# Altium schematic sheet STM32F103C8T6.SchDoc
size A4
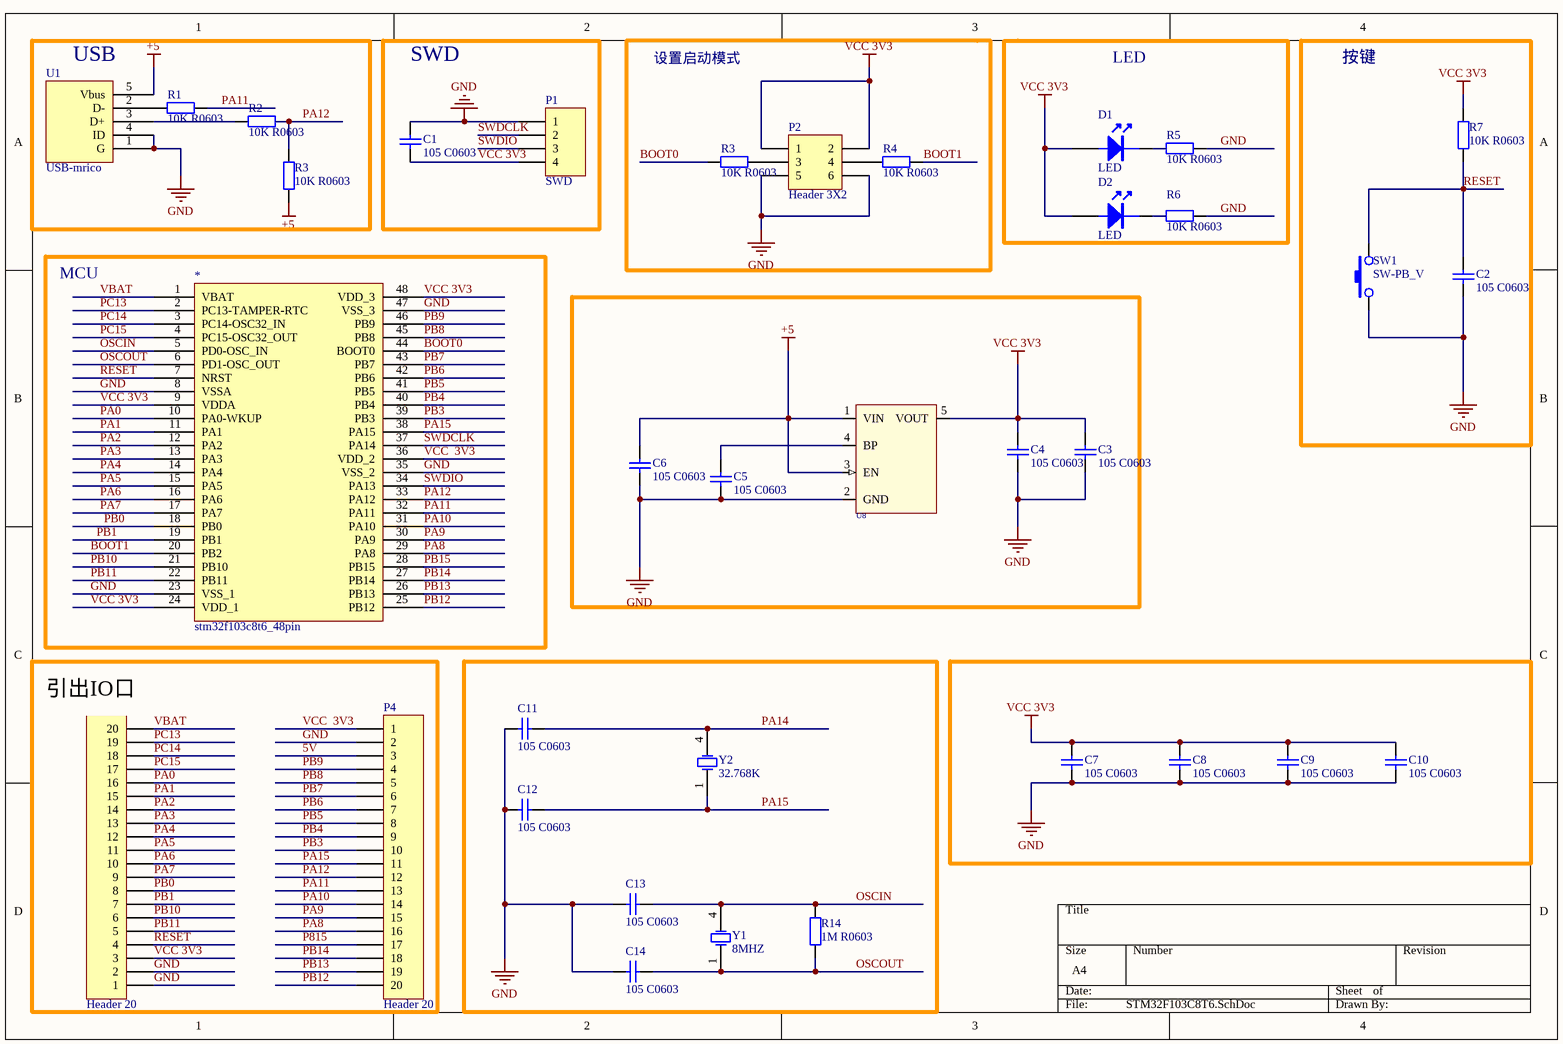
[diagram p0: STM32F103C8T6.SchDoc]

## Parts
(Parts that share a designator on the sheet are numbered #1, #2 ... from top to bottom, then left to right.)
*  stm32f103c8t6_48pin
C1  105 C0603  [C 0603]
C2  105 C0603  [C 0603]
C3  105 C0603  [C 0603]
C4  105 C0603  [C 0603]
C5  105 C0603  [C 0603]
C6  105 C0603  [C 0603]
C7  105 C0603  [C 0603]
C8  105 C0603  [C 0603]
C9  105 C0603  [C 0603]
C10  105 C0603  [C 0603]
C11  105 C0603  [C 0603]
C12  105 C0603  [C 0603]
C13  105 C0603  [C 0603]
C14  105 C0603  [C 0603]
D1  LED  [LED 0805G]
D2  LED  [LED 0805G]
P1  SWD  [HDR-1X4_H]
P2  Header 3X2  [HDR-3X2]
P3  Header 20  [HDR1X20]
P4  Header 20  [HDR1X20]
R1  10K R0603  [R 0603]
R2  10K R0603  [R 0603]
R3#1  10K R0603  [R 0603]
R3#2  10K R0603  [R 0603]
R4  10K R0603  [R 0603]
R5  10K R0603  [R 0603]
R6  10K R0603  [R 0603]
R7  10K R0603  [R 0603]
R14  1M R0603  [R 0603]
SW1  SW-PB_V  [TSW SMD-3*6*2.5]
U1  USB-mrico  [USB-micro_B]
U8  RT9193  [SOT23-5L]  (value not drawn)
Y1  8MHZ  [MC-306]
Y2  32.768K  [MC-306]

## Blocks framed on the sheet
USB: R1 R2 R3#2 U1
SWD: C1 P1
设置启动模式: P2 R3#1 R4
LED: D1 D2 R5 R6
按键: C2 R7 SW1
MCU: *

## Nets
+5: C6.2 R3#2.1 U1.5(Vbus) U8.1(VIN) U8.3(EN)
GND: *.8(VSSA) *.23(VSS_1) *.35(VSS_2) *.47(VSS_3) C1.2 C2.1 C3.1 C4.1 C5.1 C6.1 C7.1 C8.1 C9.1 C10.1 C11.1 C12.1 C13.1 C14.1 P1.1 P2.5 P2.6 P3.1 P3.2 P4.2 R5.2 R6.2 SW1.1 U1.1(G) U1.4(ID) U8.2(GND)
VCC 3V3: *.9(VDDA) *.24(VDD_1) *.48(VDD_3) C1.1 C3.2 C4.2 C7.2 C8.2 C9.2 C10.2 D1.1 D2.1 P1.4 P2.1 P2.2 P3.3 R7.2 U8.5(VOUT)
5V: P4.3
BOOT0: *.44(BOOT0) R3#1.1
BOOT1: *.20(PB2) R4.2
OSCIN: *.5(PD0-OSC_IN) C13.2 R14.2 Y1.4(OSC2)
OSCOUT: *.6(PD1-OSC_OUT) C14.2 R14.1 Y1.1(OSC1)
P815: P4.17
PA0: *.10(PA0-WKUP) P3.16
PA1: *.11(PA1) P3.15
PA2: *.12(PA2) P3.14
PA3: *.13(PA3) P3.13
PA4: *.14(PA4) P3.12
PA5: *.15(PA5) P3.11
PA6: *.16(PA6) P3.10
PA7: *.17(PA7) P3.9
PA8: *.29(PA8) P4.16
PA9: *.30(PA9) P4.15
PA10: *.31(PA10) P4.14
PA11: *.32(PA11) P4.13 R1.2
PA12: *.33(PA12) P4.12 R2.2 R3#2.2
PA14: C11.2 Y2.4(OSC2)
PA15: *.38(PA15) C12.2 P4.11 Y2.1(OSC1)
PB0: *.18(PB0) P3.8
PB1: *.19(PB1) P3.7
PB3: *.39(PB3) P4.10
PB4: *.40(PB4) P4.9
PB5: *.41(PB5) P4.8
PB6: *.42(PB6) P4.7
PB7: *.43(PB7) P4.6
PB8: *.45(PB8) P4.5
PB9: *.46(PB9) P4.4
PB10: *.21(PB10) P3.6
PB11: *.22(PB11) P3.5
PB12: *.25(PB12) P4.20
PB13: *.26(PB13) P4.19
PB14: *.27(PB14) P4.18
PB15: *.28(PB15)
PC13: *.2(PC13-TAMPER-RTC) P3.19
PC14: *.3(PC14-OSC32_IN) P3.18
PC15: *.4(PC15-OSC32_OUT) P3.17
RESET: *.7(NRST) C2.2 P3.4 R7.1 SW1.2
SWDCLK: *.37(PA14) P1.2
SWDIO: *.34(PA13) P1.3
VBAT: *.1(VBAT) P3.20
VCC  3V3: *.36(VDD_2) P4.1
NetC5_2: C5.2 U8.4(BP)
NetD1_2: D1.2 R5.1
NetD2_2: D2.2 R6.1
NetP2_3: P2.3 R3#1.2
NetP2_4: P2.4 R4.1
NetR1_1: R1.1 U1.2(D-)
NetR2_1: R2.1 U1.3(D+)

## Notes on the sheet
- (near P3) 引出IO口

## Library data of the parts
C1-C14 = Cap: Value: 104; Published: 8-Jun-2000; LatestRevisionDate: 17-Jul-2002; LatestRevisionNote: Re-released for DXP Platform.; Publisher: Altium Limited
P1 = Header 1*4: LatestRevisionDate: 17-Jul-2002; LatestRevisionNote: Re-released for DXP Platform.; Publisher: Altium Limited
P2 = Header 2*3: LatestRevisionDate: 17-Jul-2002; LatestRevisionNote: Re-released for DXP Platform.; Publisher: Altium Limited
P3 P4 = Header1* 20: LatestRevisionDate: 17-Jul-2002; LatestRevisionNote: Re-released for DXP Platform.; Publisher: Altium Limited
R1 R2 R3#1 R3#2 R4-R7 R14 = Res2: Published: 8-Jun-2000; LatestRevisionDate: 17-Jul-2002; LatestRevisionNote: Re-released for DXP Platform.; Publisher: Altium Limited
U1 = usb-STM
U8 = RT9193X_5P: ICA_MFR_NAME: RICHTEK; ICA_PARTNUM: $$2191094$$RT9193-15CU5; Part Number: TMP-13
Y1 Y2 = XTAL: Published: 8-Jun-2000; LatestRevisionDate: 17-Jul-2002; LatestRevisionNote: Re-released for DXP Platform.; Publisher: Altium Limited